# Altium schematic sheet PipeLine.SchDoc
size A3
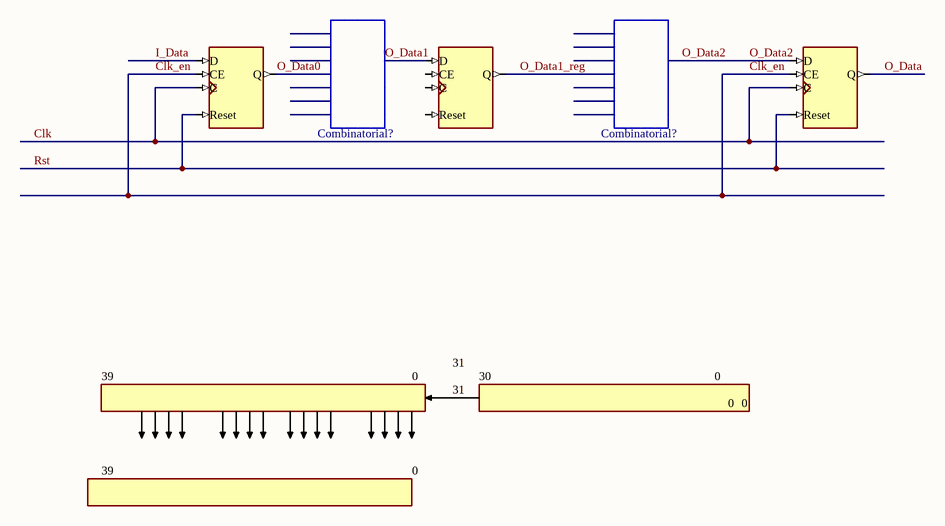
[diagram p0: PipeLine.SchDoc]

## Parts
(Parts that share a designator on the sheet are numbered #1, #2 ... from top to bottom, then left to right.)
*#1  Reg_8  (value not drawn)
*#2  Reg_8  (value not drawn)
*#3  Reg_8  (value not drawn)
Combinatorial?#1  Device Mode  (value not drawn)
Combinatorial?#2  Device Mode  (value not drawn)

## Nets
Clk: *#1.3(C) *#3.3(C)
Clk_en: *#1.2(D) *#3.2(D)
I_Data: *#1.1(D)
O_Data: *#3.6(Q)
O_Data0: *#1.6(Q) Combinatorial?#1.16
O_Data1: *#2.1(D) Combinatorial?#1.5
O_Data1_reg: *#2.6(Q) Combinatorial?#2.16
O_Data2: *#3.1(D) Combinatorial?#2.5
Rst: *#1.4(C) *#3.4(C)

Not connected (* = marked no-connect by the designer): *#2 2(D) 3(C) 4(C); Combinatorial?#1 0 1 2 3 4 6 7 8 9 10 11 12 13 14 15 17 18 19; Combinatorial?#2 0 1 2 3 4 6 7 8 9 10 11 12 13 14 15 17 18 19

## Notes on the sheet
- 31
- 39
- 0
- 30
- (in symbol Reg_8) CE; Reset

## Library data of the parts
Combinatorial?#1 Combinatorial?#2 = 40x80_1